# Altium schematic sheet Differential_Mode_Filter.SchDoc: Differential Mode Filter
size A4; CompanyName: -; DrawnBy: Naldi, López; DocumentNumber: 1; Revision: 1; SheetNumber: 2; SheetTotal: 4; Number: 25
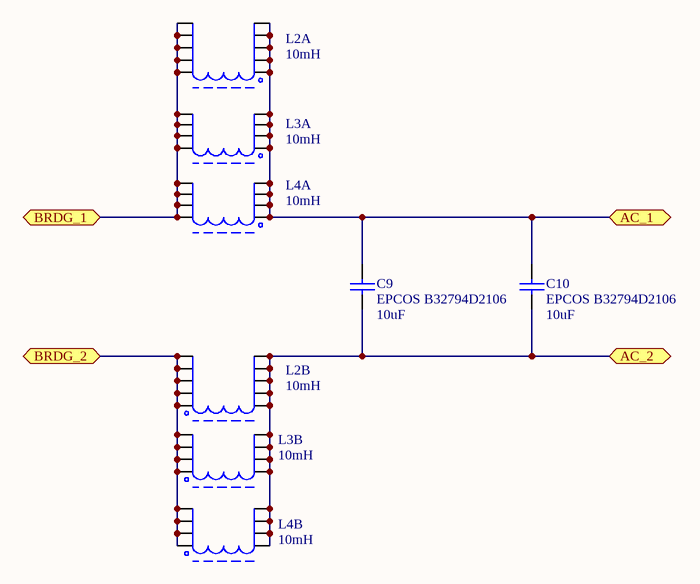
[diagram p0: Differential_Mode_Filter.SchDoc]

## Parts
C9  EPCOS B32794D2106  value 10uF  [MKP AC filtering - 10]
C10  EPCOS B32794D2106  value 10uF  [MKP AC filtering - 10]
L2  value 10mH  [Core_PM_87/70]  (hidden comment: Coupled Inductors)  (parts A,B of 2)
L3  value 10mH  [Core_PM_74/59]  (hidden comment: Coupled Inductors)  (parts A,B of 2)
L4  value 10mH  [Core_PM_62/49]  (hidden comment: Coupled Inductors)  (parts A,B of 2)

## Ports
AC_1 (bidir), AC_2 (bidir), BRDG_1 (bidir), BRDG_2 (bidir)

## Nets
AC_1: C9.2 C10.2 L2.1 L2.2 L2.3 L2.4 L2.5 L3.1 L3.2 L3.3 L3.4 L4.1 L4.2 L4.3 L4.4 ; port AC_1
AC_2: C9.1 C10.1 L2.6 L2.7 L2.8 L2.9 L2.10 L3.6 L3.7 L3.8 L3.9 L4.5 L4.6 L4.7 L4.8 ; port AC_2
BRDG_1: L2.16 L2.17 L2.18 L2.19 L2.20 L3.15 L3.16 L3.17 L3.18 L4.13 L4.14 L4.15 L4.16 ; port BRDG_1
BRDG_2: L2.11 L2.12 L2.13 L2.14 L2.15 L3.10 L3.11 L3.12 L3.13 L4.9 L4.10 L4.11 L4.12 ; port BRDG_2

## Notes on the sheet
- Title
- Size:
- Project:
- A4
- Number:
- Revision:
- Sheet
- of
- Drawn by:
- Company:
- File:

## Library data of the parts
C9 C10 = EPCOS B32794D2106: MKP AC Filtering 10uF 630Vdc; Published: 8-Jun-2000; LatestRevisionDate: 17-Jul-2002; LatestRevisionNote: Re-released for DXP Platform.; PackageReference: RAD-0.3; Publisher: Altium Limited; PackageDescription: Radial Cap, Thru-Hole; 2 Leads; 0.3 in Pin Spacing
L2 = Inductor 87/70: Coupled Inductors with Ferrite core and Air gap; Code_IEC: 1005; Published: 8-Jun-2000; LatestRevisionDate: 29-May-2009; LatestRevisionNote: IPC-7351 Footprint Added.; PackageReference: 0402-A; Publisher: Altium Limited; PackageDescription: Chip Inductor; Code_JEITA: 0402
L3 = Inductor 74/59: Coupled Inductors with Ferrite core and Air gap; Code_IEC: 1005; Published: 8-Jun-2000; LatestRevisionDate: 29-May-2009; LatestRevisionNote: IPC-7351 Footprint Added.; PackageReference: 0402-A; Publisher: Altium Limited; PackageDescription: Chip Inductor; Code_JEITA: 0402
L4 = Inductor 62/49: Coupled Inductors with Ferrite core and Air gap; Code_IEC: 1005; Published: 8-Jun-2000; LatestRevisionDate: 29-May-2009; LatestRevisionNote: IPC-7351 Footprint Added.; PackageReference: 0402-A; Publisher: Altium Limited; PackageDescription: Chip Inductor; Code_JEITA: 0402